# Altium project SMT160.PrjPcb
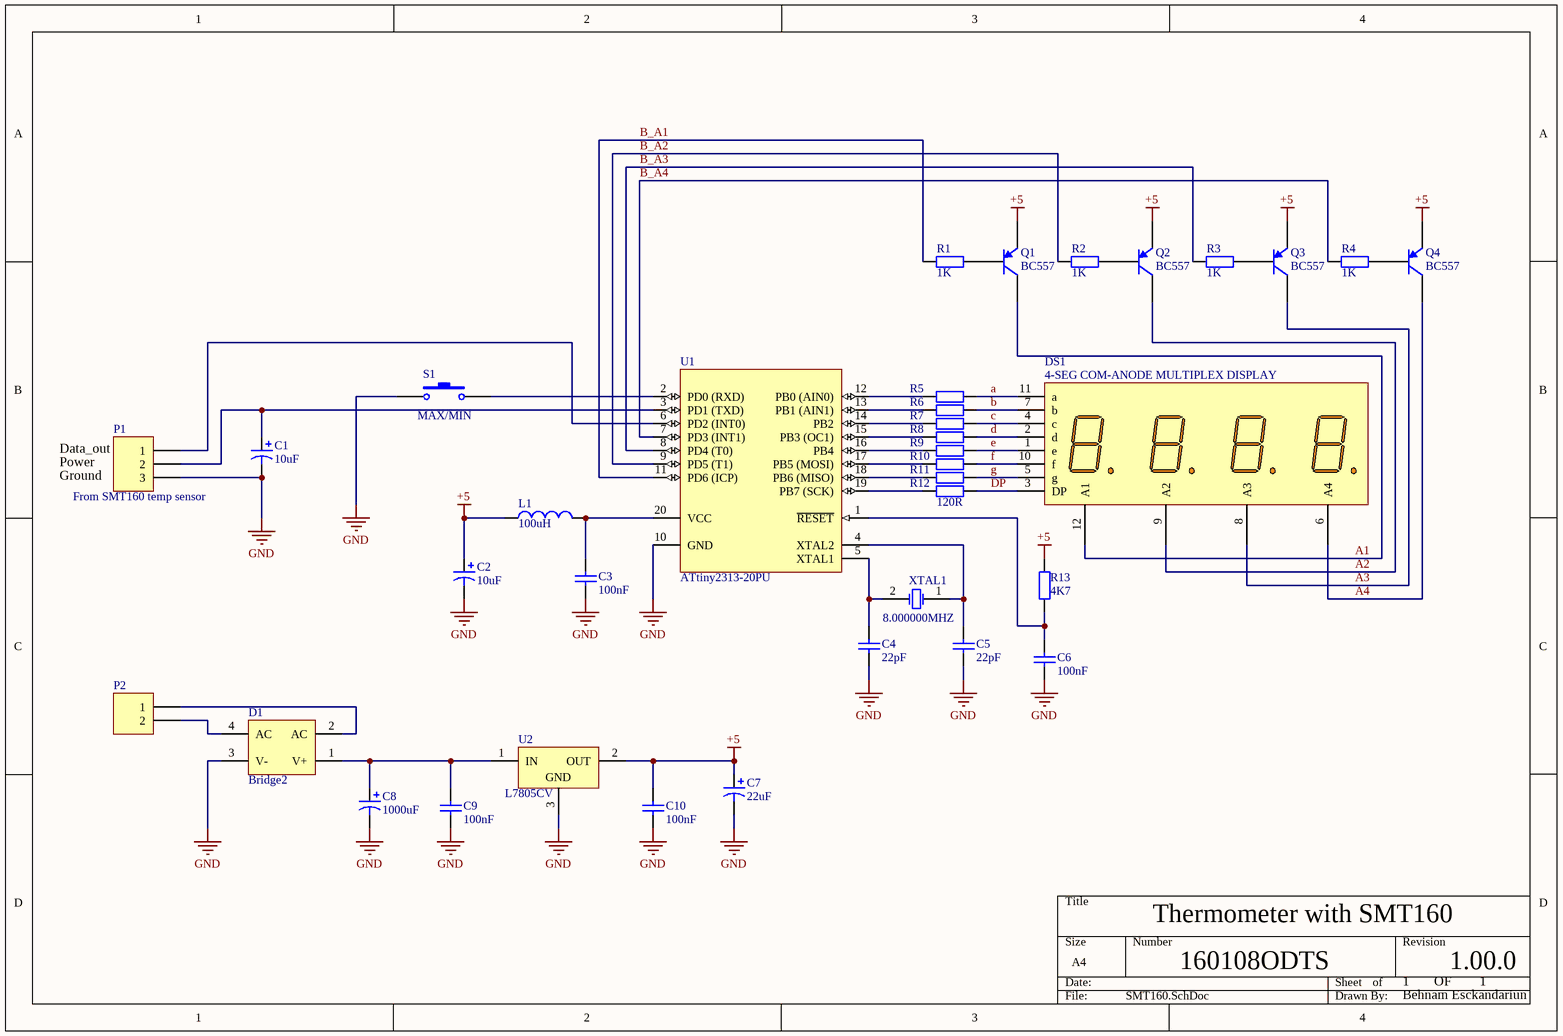
[diagram p0: SMT160.SchDoc]
1 sheet, 36 parts. Net scope: global (net labels, ports and power ports of the same name join across sheets).
Board file: SMT160.PcbDoc

## Sheet SMT160.SchDoc
size A4

### Parts
C1  value 10uF  [CAPPR2-5X6.8]  (hidden comment: Cap Pol1)
C2  value 10uF  [CAPPR2-5X6.8]  (hidden comment: Cap Pol1)
C3  value 100nF  [RAD-0.2]  (hidden comment: Cap)
C4  value 22pF  [RAD-0.1]  (hidden comment: Cap)
C5  value 22pF  [RAD-0.1]  (hidden comment: Cap)
C6  value 100nF  [RAD-0.2]  (hidden comment: Cap)
C7  value 22uF  [CAPPR2-5X6.8]  (hidden comment: Cap Pol1)
C8  value 1000uF  [CAPPR5-5X5]  (hidden comment: Cap Pol1)
C9  value 100nF  [RAD-0.2]  (hidden comment: Cap)
C10  value 100nF  [RAD-0.2]  (hidden comment: Cap)
D1  Bridge2  [D-46_6A]
DS1  4-SEG COM-ANODE MULTIPLEX DISPLAY  [LED12DIP/4D]
L1  value 100uH  [axial-0.4]  (hidden comment: Inductor)
P1  From SMT160 temp sensor  [Cannector-3]
P2  Header 2  [Cannector-2]  (value not drawn)
Q1  BC557  [BCY-W3]
Q2  BC557  [BCY-W3]
Q3  BC557  [BCY-W3]
Q4  BC557  [BCY-W3]
R1  value 1K  [AXIAL-0.4]  (hidden comment: Res2)
R2  value 1K  [AXIAL-0.4]  (hidden comment: Res2)
R3  value 1K  [AXIAL-0.4]  (hidden comment: Res2)
R4  value 1K  [AXIAL-0.4]  (hidden comment: Res2)
R5  Res2  [AXIAL-0.4]  (value not drawn)
R6  Res2  [AXIAL-0.4]  (value not drawn)
R7  Res2  [AXIAL-0.4]  (value not drawn)
R8  Res2  [AXIAL-0.4]  (value not drawn)
R9  Res2  [AXIAL-0.4]  (value not drawn)
R10  Res2  [AXIAL-0.4]  (value not drawn)
R11  Res2  [AXIAL-0.4]  (value not drawn)
R12  value 120R  [AXIAL-0.4]  (hidden comment: Res2)
R13  value 4K7  [AXIAL-0.4]  (hidden comment: Res2)
S1  MAX/MIN  [SPST-2]
U1  ATtiny2313-20PU  [20P3]
U2  L7805CV  [TO220ABN]
XTAL1  8.000000MHZ  [XTAL-1]

### Nets
+5: C2.1 C7.1 C10.2 L1.1 Q1.3(C) Q2.3(C) Q3.3(C) Q4.3(C) R13.2 U2.2(OUT)
GND: C1.2 C2.2 C3.1 C4.1 C5.1 C6.1 C7.2 C8.2 C9.1 C10.1 D1.3(V-) P1.3 S1.1 U1.10(GND) U2.3(GND)
a: DS1.11(a) R5.2
A1: DS1.12(A1) Q1.1(E)
A2: DS1.9(A2) Q2.1(E)
A3: DS1.8(A3) Q3.1(E)
A4: DS1.6(A4) Q4.1(E)
b: DS1.7(b) R6.2
B_A1: R1.1 U1.11(PD6_(ICP))
B_A2: R2.1 U1.9(PD5_(T1))
B_A3: R3.1 U1.8(PD4_(T0))
B_A4: R4.1 U1.7(PD3_(INT1))
c: DS1.4(c) R7.2
d: DS1.2(d) R8.2
DP: DS1.3(DP) R12.2
e: DS1.1(e) R9.2
f: DS1.10(f) R10.2
g: DS1.5(g) R11.2
NetC1_1: C1.1 P1.2 U1.3(PD1_(TXD))
NetC3_2: C3.2 L1.2 U1.20(VCC)
NetC4_2: C4.2 U1.5(XTAL1) XTAL1.2(OSC2)
NetC5_2: C5.2 U1.4(XTAL2) XTAL1.1(OSC1)
NetC6_2: C6.2 R13.1 U1.1(~{RESET})
NetC8_1: C8.1 C9.2 D1.1(V+) U2.1(IN)
NetD1_2: D1.2(AC) P2.1
NetD1_4: D1.4(AC) P2.2
NetP1_1: P1.1 U1.6(PD2_(INT0))
NetQ1_2: Q1.2(B) R1.2
NetQ2_2: Q2.2(B) R2.2
NetQ3_2: Q3.2(B) R3.2
NetQ4_2: Q4.2(B) R4.2
NetR5_1: R5.1 U1.12(PB0_(AIN0))
NetR6_1: R6.1 U1.13(PB1_(AIN1))
NetR7_1: R7.1 U1.14(PB2)
NetR8_1: R8.1 U1.15(PB3_(OC1))
NetR9_1: R9.1 U1.16(PB4)
NetR10_1: R10.1 U1.17(PB5_(MOSI))
NetR11_1: R11.1 U1.18(PB6_(MISO))
NetR12_1: R12.1 U1.19(PB7_(SCK))
NetS1_2: S1.2 U1.2(PD0_(RXD))

### Notes on the sheet
- Ground
- Power
- (near P1) Data_out
- Thermometer with SMT160
- 160108ODTS
- 1       OF        1
- 1.00.0
- Behnam Esckandariun

### Library data of the parts
C1 C2 C7 C8 = Cap Pol1: Polarized Capacitor (Radial); Published: 8-Jun-2000; LatestRevisionDate: 17-Jul-2002; LatestRevisionNote: Re-released for DXP Platform.; PackageReference: RB7.6-15; Publisher: Altium Limited
C3-C6 C9 C10 = Cap: Capacitor; Published: 8-Jun-2000; LatestRevisionDate: 17-Jul-2002; LatestRevisionNote: Re-released for DXP Platform.; PackageReference: RAD-0.3; Publisher: Altium Limited
D1 = Bridge2: Diode Bridge; Published: 24-Mar-1999; LatestRevisionDate: 17-Jul-2002; LatestRevisionNote: Re-released for DXP Platform.; PackageReference: D-46_6A; Publisher: Altium Limited
DS1 = Component_1
L1 = Inductor: Code_IEC: 1005; Published: 8-Jun-2000; LatestRevisionDate: 17-Jul-2002; LatestRevisionNote: Re-released for DXP Platform.; PackageReference: 0402-A; Publisher: Altium Limited; Code_JEITA: 0402
P1 = Header 3: Header, 3-Pin; LatestRevisionDate: 17-Jul-2002; LatestRevisionNote: Re-released for DXP Platform.; Publisher: Altium Limited
P2 = Header 2: Header, 2-Pin; LatestRevisionDate: 17-Jul-2002; LatestRevisionNote: Re-released for DXP Platform.; Publisher: Altium Limited
Q1-Q4 = BC557: PNP General-purpose Transistor; Package Information: Latest Revision: rev3, May-2000; Code - JEDEC: TO-92; Published: 17-Sep-2003; Datasheet: Latest Revision: 15-Apr-1999; Package Reference: SOT54; Publisher: Altium Limited
R1-R4 R12 R13 = Res2: Resistor; Published: 8-Jun-2000; Publisher: Altium Limited
  R1-R4 R12: Revision: July-2002: Re-released for DXP Platform.
  R13: LatestRevisionDate: 17-Jul-2002; LatestRevisionNote: Re-released for DXP Platform.; PackageReference: AXIAL-0.4
R5-R11 = Res2: Resistor; Value: 220R; Published: 8-Jun-2000; Revision: July-2002: Re-released for DXP Platform.; Publisher: Altium Limited
S1 = SW-PB: Switch; Published: 24-Mar-1999; LatestRevisionDate: 17-Jul-2002; LatestRevisionNote: Re-released for DXP Platform.; PackageReference: SPST-2; Publisher: Altium Limited
U1 = AT90S2313-10PI: 8-Bit AVR Microcontroller with 2K Bytes of In-System Programmable Flash Memory; Published: 17-Sep-2003; LatestRevisionDate: 04-Mar-2005; LatestRevisionNote: Stylized 3D Model Added.; DatasheetVersion: 0839I-AVR-06/02; PackageVersion: Aug-1999; PackageReference: 20P3; Publisher: Altium Limited; PackageDescription: DIP; 20 Leads; Row Spacing 7.62 mm; Pitch 2.54 mm; Code_JEDEC: MS-001-AD; ComponentLink1Description: Manufacturer Link; ComponentLink1URL: http://www.atmel.com; ComponentLink2Description: Datasheet; ComponentLink2URL: http://www.atmel.com/dyn/resources/prod_documents/doc0839.pdf
U2 = L7805CV: Positive Voltage Regulator; Note: Tab is connected to pin 3 (GND).; Published: 24-Aug-2001; LatestRevisionDate: 17-Jul-2002; LatestRevisionNote: Re-released for DXP Platform.; DatasheetVersion: Dec-1998; PackageVersion: Jun-1998; PackageReference: TO220ABN; Publisher: Altium Limited; PackageDescription: TO, Thru-Hole, Vertical, Heatsink Mounted; 3 In-Line Leads; Pitch 2.54 mm; Pin sequence 1, 3, 2; ComponentLink1Description: Manufacturer Link; ComponentLink1URL: http://www.st.com/
XTAL1 = XTAL: Crystal Oscillator; Published: 8-Jun-2000; LatestRevisionDate: 17-Jul-2002; LatestRevisionNote: Re-released for DXP Platform.; PackageReference: R38; Publisher: Altium Limited